# Altium project RFSOC_SAWG.PrjPCB (part 10 of 10)

## Sheet AWG_USB_Serial_Quad.SchDoc: RFSOC SAWG
size 420 x 297 mm; Author: Paweł Kulik; DrawnBy: G.Kasprowicz; Address1: Warsaw Univeristy of Technology; Address2: Nowowiejska 15/19; DocumentNumber: 9; Revision: 1; SheetNumber: 9; SheetTotal: 20; EDA_Number: ARTIQ; Projet: ARTIQ/SINARA; ModifiedBy: -; CheckedDate: -; Title2: USB Serial Quad; DivGrp: ISE; Designer: G.Kasprowicz; ProjectName: ARTIQ/SINARA
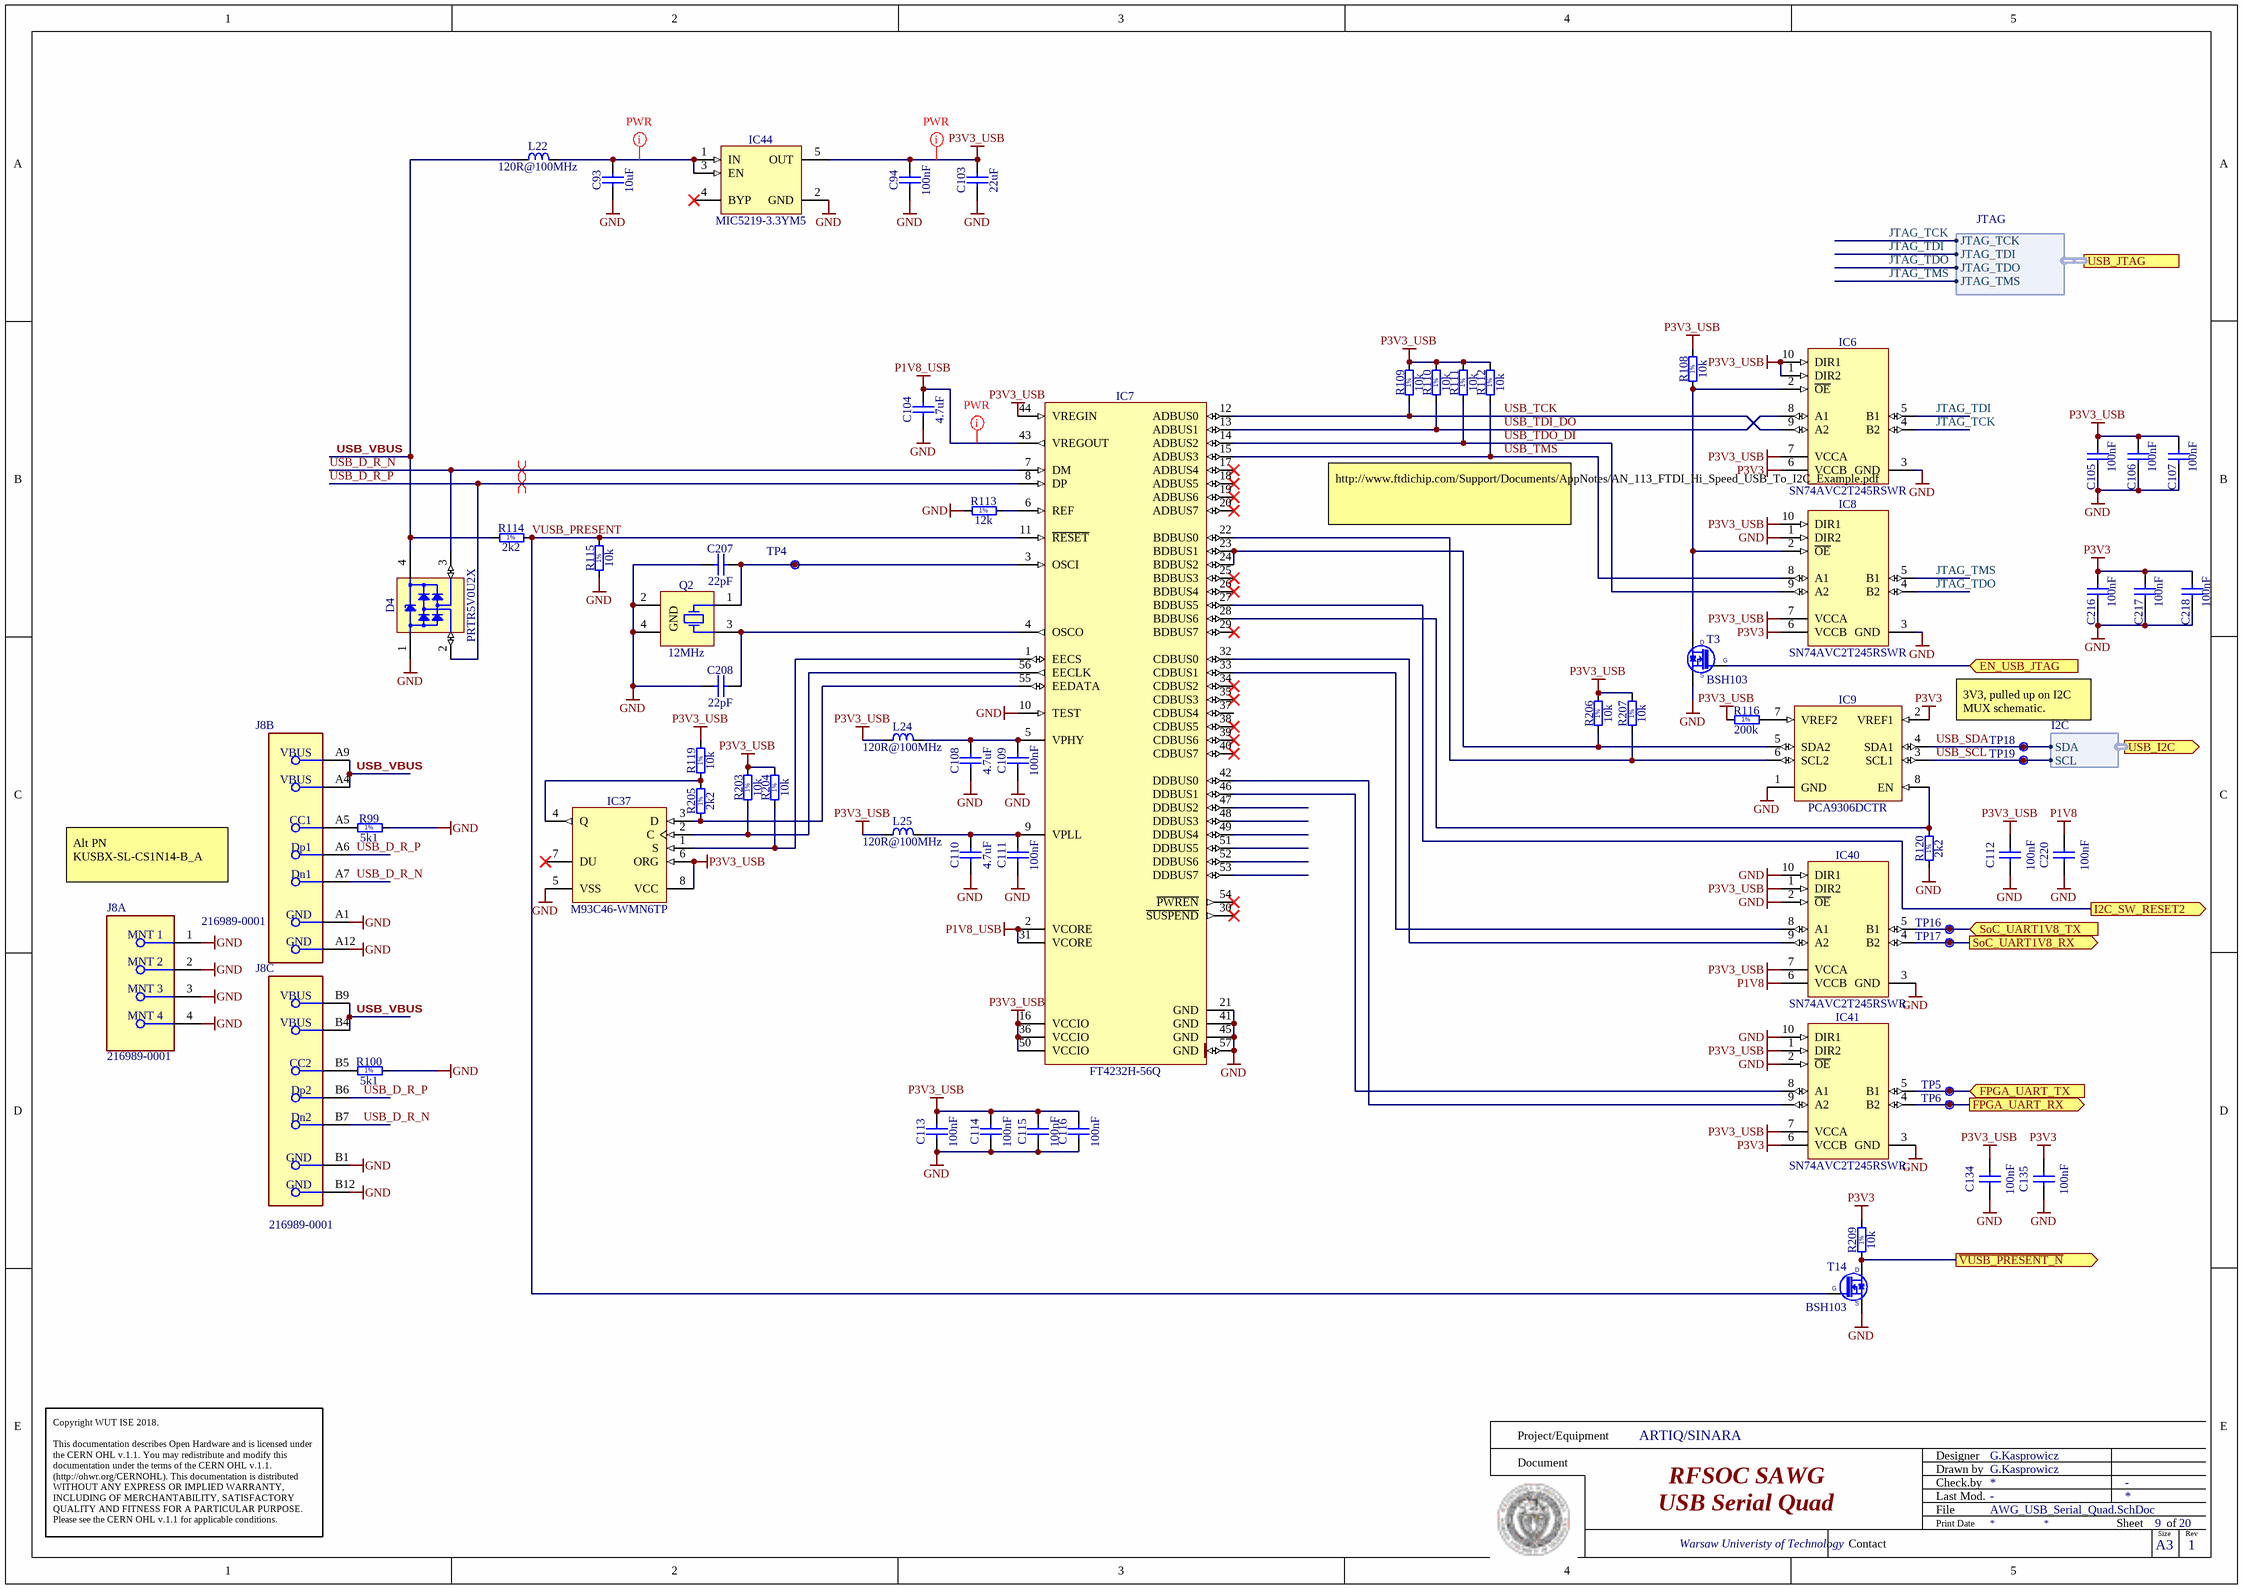
[diagram p19: AWG_USB_Serial_Quad.SchDoc]

### Parts
C93  10uF  [CAPC1608X87N]
C94  100nF  [CAPC1005X55N]
C103  22uF  [CAPC1608X90N]
C104  4.7uF  [CAPC2012X135N]
C105  100nF  [CAPC0603X33N]
C106  100nF  [CAPC0603X33N]
C107  100nF  [CAPC0603X33N]
C108  4.7uF  [CAPC2012X135N]
C109  100nF  [CAPC1005X55N]
C110  4.7uF  [CAPC2012X135N]
C111  100nF  [CAPC1005X55N]
C112  100nF  [CAPC0603X33N]
C113  100nF  [CAPC1005X55N]
C114  100nF  [CAPC1005X55N]
C115  100nF  [CAPC1005X55N]
C116  100nF  [CAPC1005X55N]
C134  100nF  [CAPC0603X33N]
C135  100nF  [CAPC0603X33N]
C207  22pF  [CAPC1005X55N]
C208  22pF  [CAPC1005X55N]
C216  100nF  [CAPC0603X33N]
C217  100nF  [CAPC0603X33N]
C218  100nF  [CAPC0603X33N]
C220  100nF  [CAPC0603X33N]
D4  PRTR5V0U2X  [SOT190P230X110-4N]
IC6  SN74AVC2T245RSWR  [QFN40P140X180X55-10N]
IC7  FT4232H-56Q  [QFN50P800X800X100-57N-S620]
IC8  SN74AVC2T245RSWR  [QFN40P140X180X55-10N]
IC9  PCA9306DCTR  [SOP65P400X130-8N]
IC37  M93C46-WMN6TP  [SOIC127P600X175-8N]
IC40  SN74AVC2T245RSWR  [QFN40P140X180X55-10N]
IC41  SN74AVC2T245RSWR  [QFN40P140X180X55-10N]
IC44  MIC5219-3.3YM5  [SOT95P280X145-5N]
J8  216989-0001  [FP-216989-0001-MFG]  (parts A,B,C of 3)
L22  120R@100MHz  [INDC1608X65N]
L24  120R@100MHz  [INDC1608X65N]
L25  120R@100MHz  [INDC1608X65N]
Q2  12MHz  [XTAL_TXC_7M]
R99  5k1  [RESC1005X40N]
R100  5k1  [RESC1005X40N]
R108  10k  [RESC1005X40N]
R109  10k  [RESC1005X40N]
R110  10k  [RESC1005X40N]
R111  10k  [RESC1005X40N]
R112  10k  [RESC1005X40N]
R113  12k  [RESC1005X40N]
R114  2k2  [RESC1005X40N]
R115  10k  [RESC1005X40N]
R116  200k  [RESC1005X40N]
R119  10k  [RESC1005X40N]
R120  2k2  [RESC1005X40N]
R203  10k  [RESC1005X40N]
R204  10k  [RESC1005X40N]
R205  2k2  [RESC1005X40N]
R206  10k  [RESC1005X40N]
R207  10k  [RESC1005X40N]
R209  10k  [RESC1005X40N]
T3  BSH103  [SOT95P230X110-3N]
T14  BSH103  [SOT95P230X110-3N]
TP4  Test Point  [TPS127]  (value not drawn)  (no BOM)
TP5  Test Point  [TPS127]  (value not drawn)  (no BOM)
TP6  Test Point  [TPS127]  (value not drawn)  (no BOM)
TP16  Test Point  [TPS127]  (value not drawn)  (no BOM)
TP17  Test Point  [TPS127]  (value not drawn)  (no BOM)
TP18  Test Point  [TPS127]  (value not drawn)  (no BOM)
TP19  Test Point  [TPS127]  (value not drawn)  (no BOM)

### Ports
EN_USB_JTAG (in), FPGA_UART_RX (out), FPGA_UART_TX (in), I2C_SW_RESET2 (out), SoC_UART1V8_RX (out), SoC_UART1V8_TX (in), USB_I2C (out, harness I2C), USB_JTAG (harness JTAG), ~{VUSB_PRESENT_N} (out)

### Harnesses
JTAG: JTAG_TCK, JTAG_TDI, JTAG_TDO, JTAG_TMS
I2C: SDA, SCL

### Nets
GND: C93.1 C94.1 C103.1 C104.1 C105.1 C106.1 C107.1 C108.1 C109.1 C110.1 C111.1 C112.1 C113.1 C114.1 C115.1 C116.1 C134.1 C135.1 C207.1 C208.1 C216.1 C217.1 C218.1 C220.1 D4.1(GND) IC6.3(GND) IC7.10(TEST) IC7.21(GND) IC7.41(GND) IC7.45(GND) IC7.57(GND) IC8.1(DIR2) IC8.3(GND) IC9.1(GND) IC37.5(VSS) IC40.2(~{OE}) IC40.3(GND) IC40.10(DIR1) IC41.2(~{OE}) IC41.3(GND) IC41.10(DIR1) IC44.2(GND) J8.1(MNT_1) J8.2(MNT_2) J8.3(MNT_3) J8.4(MNT_4) J8.A1(GND) J8.A12(GND) J8.B1(GND) J8.B12(GND) Q2.2(GND) Q2.4(GND) R99.2 R100.2 R113.1 R115.1 R120.1 T3.2(S) T14.2(S)
P1V8: C220.2 IC40.6(VCCB)
P1V8_USB: C104.2 IC7.2(VCORE) IC7.31(VCORE) IC7.43(VREGOUT)
P3V3: C135.2 C216.2 C217.2 C218.2 IC6.6(VCCB) IC8.6(VCCB) IC9.2(VREF1) IC41.6(VCCB) R209.2
P3V3_USB: C94.2 C103.2 C105.2 C106.2 C107.2 C112.2 C113.2 C114.2 C115.2 C116.2 C134.2 IC6.1(DIR2) IC6.7(VCCA) IC6.10(DIR1) IC7.16(VCCIO) IC7.36(VCCIO) IC7.44(VREGIN) IC7.50(VCCIO) IC8.7(VCCA) IC8.10(DIR1) IC37.6(ORG) IC37.8(VCC) IC40.1(DIR2) IC40.7(VCCA) IC41.1(DIR2) IC41.7(VCCA) IC44.5(OUT) L24.1 L25.1 R108.2 R109.2 R110.2 R111.2 R112.2 R116.1 R119.2 R203.2 R204.2 R206.2 R207.2
~{VUSB_PRESENT_N}: R209.1 T14.3(D) ; port ~{VUSB_PRESENT_N}
CPLD_IO2: IC41.5(B1) TP5.1 ; port FPGA_UART_TX
EN_USB_JTAG: T3.1(G) ; port EN_USB_JTAG
FPGA_UART_RX: IC41.4(B2) TP6.1 ; port FPGA_UART_RX
I2C_SW_RESET2: IC7.27(BDBUS5) ; port I2C_SW_RESET2
JTAG_TCK: IC6.4(B2) ; port USB_JTAG.JTAG_TCK
JTAG_TDI: IC6.5(B1) ; port USB_JTAG.JTAG_TDI
JTAG_TDO: IC8.4(B2) ; port USB_JTAG.JTAG_TDO
JTAG_TMS: IC8.5(B1) ; port USB_JTAG.JTAG_TMS
UART0_RX: IC40.4(B2) TP17.1 ; port SoC_UART1V8_RX
UART0_TX: IC40.5(B1) TP16.1 ; port SoC_UART1V8_TX
USB_D_R_N: D4.3(I/O2) IC7.7(DM) J8.A7(Dn1) J8.B7(Dn2)
USB_D_R_P: D4.2(I/O1) IC7.8(DP) J8.A6(Dp1) J8.B6(Dp2)
USB_SCL: IC9.3(SCL1) TP19.1 ; port USB_I2C.SCL
USB_SDA: IC9.4(SDA1) TP18.1 ; port USB_I2C.SDA
USB_TCK: IC6.9(A2) IC7.12(ADBUS0) R109.1
USB_TDI_DO: IC6.8(A1) IC7.13(ADBUS1) R110.1
USB_TDO_DI: IC7.14(ADBUS2) IC8.9(A2) R111.1
USB_TMS: IC7.15(ADBUS3) IC8.8(A1) R112.1
USB_VBUS: D4.4(VCC) J8.A4(VBUS) J8.A9(VBUS) J8.B4(VBUS) J8.B9(VBUS) L22.1 R114.1
VUSB_PRESENT: IC7.11(~{RESET}) R114.2 R115.2 T14.1(G)
NetC93_2: C93.2 IC44.1(IN) IC44.3(EN) L22.2
NetC108_2: C108.2 C109.2 IC7.5(VPHY) L24.2
NetC110_2: C110.2 C111.2 IC7.9(VPLL) L25.2
NetC207_2: C207.2 IC7.3(OSCI) Q2.1(X) TP4.1
NetC208_2: C208.2 IC7.4(OSCO) Q2.3(X)
NetIC6_2: IC6.2(~{OE}) IC8.2(~{OE}) R108.1 T3.3(D)
NetIC7_1: IC7.1(EECS) IC37.1(S) R204.1
NetIC7_6: IC7.6(REF) R113.2
NetIC7_22: IC7.22(BDBUS0) IC9.6(SCL2) R207.1
NetIC7_23: IC7.23(BDBUS1) IC7.24(BDBUS2) IC9.5(SDA2) R206.1
NetIC7_28: IC7.28(BDBUS6) IC9.8(EN) R120.2
NetIC7_32: IC7.32(CDBUS0) IC40.9(A2)
NetIC7_33: IC7.33(CDBUS1) IC40.8(A1)
NetIC7_42: IC7.42(DDBUS0) IC41.9(A2)
NetIC7_46: IC7.46(DDBUS1) IC41.8(A1)
NetIC7_55: IC7.55(EEDATA) IC37.3(D) R205.2
NetIC7_56: IC7.56(EECLK) IC37.2(C) R203.1
NetIC9_7: IC9.7(VREF2) R116.2
NetIC37_4: IC37.4(Q) R119.1 R205.1
NetJ8_A5: J8.A5(CC1) R99.1
NetJ8_B5: J8.B5(CC2) R100.1

Not connected (* = marked no-connect by the designer): IC7 17(ADBUS4)* 18(ADBUS5)* 19(ADBUS6)* 20(ADBUS7)* 25(BDBUS3)* 26(BDBUS4)* 29(BDBUS7)* 30(~{SUSPEND})* 34(CDBUS2)* 35(CDBUS3)* 37(CDBUS4) 38(CDBUS5)* 39(CDBUS6)* 40(CDBUS7)* 47(DDBUS2) 48(DDBUS3) 49(DDBUS4) 51(DDBUS5) 52(DDBUS6) 53(DDBUS7) 54(~{PWREN})*; IC37 7(DU)*; IC44 4(BYP)*

### Layout directives
differential pair; differential pair class Diff_90Ohm: USB_D_R_N, USB_D_R_P
net class PWR: NetC93_2, P1V8_USB, P3V3_USB

### Notes on the sheet
- http://www.ftdichip.com/Support/Documents/AppNotes/AN_113_FTDI_Hi_Speed_USB_To_I2C_Example.pdf
- 3V3, pulled up on I2C MUX schematic.
- Alt PN KUSBX-SL-CS1N14-B_A
- Project/Equipment
- Document
- Designer
- Drawn by
- Check.by
- Copyright WUT ISE 2018.
  This documentation describes Open Hardware and is licensed under the CERN OHL v.1.1. You may redistribute and modify this documentation under the terms of the CERN OHL v.1.1. (http://ohwr.org/CERNOHL). This documentation is distributed WITHOUT ANY EXPRESS OR IMPLIED WARRANTY, INCLUDING OF MERCHANTABILITY, SATISFACTORY QUALITY AND FITNESS FOR A PARTICULAR PURPOSE. Please see the CERN OHL v.1.1 for applicable conditions.
- Contact
- File
- Last Mod.
- Print Date
- Sheet
- Size
- A3
- of
- Rev
- (in symbol R0402_2K2_1%_0.0625W_100PPM) 1%
- (in symbol R0402_5K1_1%_0.0625W_100PPM) 1%
- (in symbol R0402_10K_1%_0.0625W_100PPM) 1%
- (in symbol R0402_12K_1%_0.0625W_100PPM) 1%
- (in symbol R0402_200K_1%_0.0625W_100PPM) 1%

### Library data of the parts
C93 = CC0603_10UF_6.3V_20%_X5R: Non-polarised capacitor; Part Description: SMD Multilayer Chip Ceramic Capacitor; Manufacturer: GENERIC; Manufacturer1 Part Number: C0603C106M9PAC; Voltage: 6.3V; TC: X5R; Tolerance: ±20%; Part Number: CC0603_10UF_6.3V_20%_X5R; Component Kind: Standard; Component Type: Standard; Pin Count: 2; Value: 10uF; Status: Preferred; Manufacturer Part Number: CC0603_10uF_6.3V_20%_X5R; Case: 0603; Mounted: Yes; Socket: No; SMD: Yes; Sense: No; Manufacturer1 Example: KEMET; Manufacturer1 ComponentHeight: 0.95mm; HelpURL: \\cern.ch\dfs\Applications\Altium\Datasheets\CC0603_X5R_KEMET.pdf; Author: CERN DEM JLC; CreateDate: 2007-12-03; LatestRevisionDate: 2007-12-03
C94 C109 C111 C113-C116 = CC0402_100NF_16V_10%_X5R: Non-polarised capacitor; Part Description: SMD Multilayer Chip Ceramic Capacitor; Manufacturer: GENERIC; Manufacturer1 Part Number: GRM155R61C104KA88D; Voltage: 16V; TC: X5R; Tolerance: ±10%; Part Number: CC0402_100NF_16V_10%_X5R; Component Kind: Standard; Component Type: Standard; Pin Count: 2; Value: 100nF; Status: None; Manufacturer Part Number: CC0402_100NF_16V_10%_X5R; Case: 0402; Mounted: Yes; Socket: No; SMD: Yes; Sense: No; Manufacturer1 Example: MURATA; Manufacturer1 ComponentHeight: 0.55mm; HelpURL: \\cern.ch\dfs\Applications\Altium\Datasheets\CC0402_X5R_MURATA_GRM.pdf; Author: CERN DEM JLC; CreateDate: 10.12.2013; LatestRevisionDate: 10.12.2013
C103 = CC0603_22UF_6.3V_20%_X5R: Non-polarised capacitor; Part Description: SMD Multilayer Chip Ceramic Capacitor; Manufacturer: GENERIC; Manufacturer1 Part Number: C1608X5R0J226M080; Voltage: 6.3V; TC: X5R; Tolerance: ±20%; Part Number: CC0603_22UF_6.3V_20%_X5R; Component Kind: Standard; Component Type: Standard; Pin Count: 2; Value: 22uF; Status: None; Manufacturer Part Number: CC0603_22UF_6.3V_20%_X5R; Case: 0603; Mounted: Yes; Socket: No; SMD: Yes; Sense: No; Manufacturer1 Example: TDK; Manufacturer1 ComponentHeight: 0.9mm; HelpURL: \\cern.ch\dfs\Applications\Altium\Datasheets\CC0603_X5R_TDK_C.pdf; Author: CERN DEM JLC; CreateDate: 16.12.2013; LatestRevisionDate: 03.12.2020
C104 C108 C110 = CC0805_4.7UF_10V_10%_X5R: Non-polarised capacitor; Part Description: SMD Multilayer Chip Ceramic Capacitor; Manufacturer: GENERIC; Manufacturer1 Part Number: 222224013672; Voltage: 10V; TC: X5R; Tolerance: ±10%; Part Number: CC0805_4.7UF_10V_10%_X5R; Component Kind: Standard; Component Type: Standard; Pin Count: 2; Value: 4.7uF; Status: Preferred; Manufacturer Part Number: CC0805_4.7UF_10V_10%_X5R; Case: 0805; Mounted: Yes; Socket: No; SMD: Yes; Sense: No; Manufacturer1 Example: PHYCOMP; Manufacturer1 ComponentHeight: 1.45mm; HelpURL: \\cern.ch\dfs\Applications\Altium\Datasheets\CC0805_X5R_PHYCOMP_HC.pdf; Author: CERN DEM JLC; CreateDate: 03.12.2007; LatestRevisionDate: 03.12.2007
C105-C107 C112 C134 C135 C216-C218 C220 = CC0201_100NF_6.3V_10%_X5R: Non-polarised capacitor; Part Description: SMD Multilayer Chip Ceramic Capacitor; Manufacturer: GENERIC; Manufacturer1 Part Number: 02016D104KAT2A; Voltage: 6.3V; TC: X5R; Tolerance: ±10%; Part Number: CC0201_100NF_6.3V_10%_X5R; Component Kind: Standard; Component Type: Standard; Pin Count: 2; Value: 100nF; Status: Not Recommended; Manufacturer Part Number: CC0201_100NF_6.3V_10%_X5R; Case: 0201; Mounted: Yes; Socket: No; SMD: Yes; Sense: No; Manufacturer1 Example: AVX; Manufacturer1 ComponentHeight: 0.33mm; HelpURL: \\cern.ch\dfs\Applications\Altium\Datasheets\CC0201_X5R_AVX.pdf; Author: CERN DEM JLC; CreateDate: 2007-12-03; LatestRevisionDate: 2007-12-03
C207 C208 = CC0402_22PF_50V_5%_C0G: Non-polarised capacitor; Part Description: SMD Multilayer Chip Ceramic Capacitor; Manufacturer: GENERIC; Manufacturer1 Part Number: C0402C220J5GACTU; Voltage: 50V; TC: C0G/NP0; Tolerance: ±5%; Part Number: CC0402_22PF_50V_5%_C0G; Component Kind: Standard; Component Type: Standard; Pin Count: 2; Value: 22pF; Status: Preferred; Manufacturer Part Number: CC0402_22PF_50V_5%_C0G; Case: 0402; Mounted: Yes; Socket: No; SMD: Yes; Sense: No; Manufacturer1 Example: KEMET; Manufacturer1 ComponentHeight: 0.55mm; HelpURL: \\cern.ch\dfs\Applications\Altium\Datasheets\CC0805_C0G_KEMET_(Commercial Grade).pdf; Author: CERN DEM JLC; CreateDate: 03.12.2007; LatestRevisionDate: 03.12.2007
D4 = PRTR5V0U2X: Ultra Low Capacitance Double Rail-to-Rail ESD Protection Diode; Part Description: Ultra Low Capacitance (1pF) Double Rail-to-Rail ESD Protection Diode (8kV); Manufacturer: NXP SEMICONDUCTORS; Voltage: 5.5V; PressFit: No; Bonding: No; Part Number: PRTR5V0U2X; Component Kind: Standard; Component Type: Standard; Device: PRTR5V0U2X; PackageDescription: SOT143B, SOT, 1.90mm Pitch; 4 Pin, 1.30mm W X 2.90mm L X 1.10mm H body, IPC Medium Density; Manufacturer Part Number: PRTR5V0U2X; Pin Count: 4; Case: SOT143B; Mounted: Yes; Socket: No; SMD: Yes; Sense: No; ComponentHeight: 1.1mm; HelpURL: \\cern.ch\dfs\Applications\Altium\Datasheets\PRTR5V0U2X.pdf; Author: CERN DEM JLC; CreateDate: 22.03.2011; LatestRevisionDate: 22.03.2011
IC6 IC8 IC40 IC41 = SN74AVC2T245RSWR: Dual-Bit Dual-Supply Bus Transceiver With Configurable Voltage Translation and 3-State Outputs; Manufacturer: TEXAS INSTRUMENTS; PressFit: No; Bonding: No; Part Number: SN74AVC2T245RSWR; Component Kind: Standard; Component Type: Standard; Device: SN74AVC2T245RSWR; PackageDescription: QFN, 0.40mm Pitch, Rect.;10 Pin, 1.80mm L X 1.40mm W X 0.55mm H Body, IPC Medium Density; Status: Not Recommended; Part Description: Dual-Bit Dual-Supply Bus Transceiver With Configurable Voltage Translation and 3-State Outputs; Manufacturer Part Number: SN74AVC2T245RSWR; Pin Count: 10; Case: QFN10; Mounted: Yes; Socket: No; SMD: Yes; Sense: No; ComponentHeight: 0.55mm; Author: CERN DEM JLC; HelpURL: \\cern.ch\dfs\Applications\Altium\Datasheets\SN74AVC2T245RSWR.pdf; CreateDate: 07.07.2014; LatestRevisionDate: 30.03.2017
IC7 = FT4232H-56Q: Quad High Speed USB to Multipurpose UART/MPSSE IC; Manufacturer: FUTURE TECHNOLOGY DEVICES INTERNATIONAL (FTDI); PressFit: No; Bonding: No; Part Number: FT4232H-56Q; Component Kind: Standard; Component Type: Standard; Device: FT4232H-56Q; PackageDescription: QFN, 0.50mm Pitch, Square; 56 Pin, 8.00mm L X 8.00mm W X 1.00mm H body (6.1mm X 6.1mm Thermal tab), IPC Medium Density; Part Description: Quad High Speed USB to Multipurpose UART/MPSSE IC; Manufacturer Part Number: FT4232H-56Q; Pin Count: 57; Case: QFN56; Mounted: Yes; Socket: No; SMD: Yes; Sense: No; ComponentHeight: 1mm; Author: CERN DEM JLC; HelpURL: \\cern.ch\dfs\Applications\Altium\Datasheets\FT4232H-56Q.pdf; CreateDate: 11.10.2016; LatestRevisionDate: 11.10.2016
IC9 = PCA9306DCTR: Dual Bidirectional I2C Bus And SMBus Voltage-Level Translator; Manufacturer: TEXAS INSTRUMENTS; PressFit: No; Bonding: No; Part Number: PCA9306DCTR; Component Kind: Standard; Component Type: Standard; Device: PCA9306DCTR; PackageDescription: SOP, 0.65mm, Pitch; 8 Pin, 2.80mm W X 2.95mm L X 1.30mm H Body, PC Medium Density; Part Description: Dual Bidirectional I2C Bus And SMBus Voltage-Level Translator; Manufacturer Part Number: PCA9306DCTR; Pin Count: 8; Case: SSOP8; Mounted: Yes; Socket: No; SMD: Yes; Sense: No; ComponentHeight: 1.3mm; Author: CERN DEM JLC; HelpURL: \\cern.ch\dfs\Applications\Altium\Datasheets\PCA9306DCTR.pdf; CreateDate: 25.02.2013; LatestRevisionDate: 11.02.2016
IC37 = M93C46-WMN6TP: 2.5 to 5.5 V, 1Kb (128x8) Serial Microwire Bus EEPROM; Part Description: 1Kbit (128 x 8 bit or 64 x 16 bit) MICROWIRE® Serial Access EEPROM; Manufacturer: ST MICROELECTRONICS; PressFit: No; Bonding: No; Part Number: M93C46-WMN6TP; Component Kind: Standard; Component Type: Standard; Device: M93C46-WMN6TP; PackageDescription: SOIC 8, Pitch 1.27mm - Body 4x5mm, IPC Medium Density; Manufacturer Part Number: M93C46-WMN6TP; Pin Count: 8; Case: SOIC8; Mounted: Yes; Socket: No; SMD: Yes; Sense: No; ComponentHeight: 1.75mm; HelpURL: \\cern.ch\dfs\Applications\Altium\Datasheets\M93C46-WMN6TP.pdf; Author: CERN DEM JLC; CreateDate: 15.11.2012; LatestRevisionDate: 15.11.2012
IC44 = MIC5219-3.3YM5: 500mA Peak Output LDO Regulator; Part Description: 3.3V 500mA Peak Output Low Drop-Out  (LDO) Regulator; Manufacturer: MICROCHIP TECHNOLOGY; PressFit: No; Bonding: No; Part Number: MIC5219-3.3YM5; Component Kind: Standard; Component Type: Standard; Device: MIC5219-3.3YM5; PackageDescription: SOT, 0.95mm pitch; 5 pin, 1.60mm W X 2.90mm L X 1.45mm H body, IPC Medium Density; Manufacturer Part Number: MIC5219-3.3YM5; Pin Count: 5; Case: SOT23-5; Mounted: Yes; Socket: No; SMD: Yes; Sense: No; ComponentHeight: 1.45mm; HelpURL: \\cern.ch\dfs\Applications\Altium\Datasheets\MIC5219-3.3YM5.pdf; Author: CERN DEM WB; CreateDate: 2019-04-16; LatestRevisionDate: 2019-04-16
J8 = CMP-04767-000020-1: CONN RCPT USB2.0 TYPE C 24POS RA; Manufacturer Part Number: 216989-0001
L22 L24 L25 = IND0603_MURATA_BLM18SG121TN1D: Inductor; Part Description: SMD EMIFIL Suppression Chip Ferrite Bead; Manufacturer: MURATA; Power: 3A; Resistance: 0.025R; Tolerance: ±25%; Part Number: IND0603_MURATA_BLM18SG121TN1D; Component Kind: Standard; Component Type: Standard; Pin Count: 2; Value: 120R@100MHz; Status: None; Manufacturer Part Number: BLM18SG121TN1D; Case: 0603; Mounted: Yes; Socket: No; SMD: Yes; Sense: No; ComponentHeight: 0.65mm; HelpURL: \\cern.ch\dfs\Applications\Altium\Datasheets\IND0603_MURATA_BLM18S.pdf; Author: CERN DEM JLC; CreateDate: 23.07.2014; LatestRevisionDate: 23.07.2014
Q2 = XTAL_12MHZ_TXC_7M-12.000MAAJ-T: Crystal 4 pins 1=XTAL Control 2=GND3=XTAL 4=GND; Part Description: ±30ppm 18pF -20°C to +70°C  4 Pins, 3.2x2.5X0.8mm, SMD Sealing Crystal, 7M Series; Manufacturer: TXC CORPORATION; PressFit: No; Bonding: No; Part Number: XTAL_12MHZ_TXC_7M-12.000MAAJ-T; Component Kind: Standard; Component Type: Standard; PackageDescription: 4 Pins, 2.5x3.2mm, SMD Sealing Crystal, 7M Serie; Value: 12MHz; Manufacturer Part Number: 7M-12.000MAAJ-T; Pin Count: 4; Mounted: Yes; Socket: No; SMD: Yes; Sense: No; ComponentHeight: 0.8mm; HelpURL: \\cern.ch\dfs\Applications\Altium\Datasheets\XTAL_TXC_7M.pdf; Author: CERN DEM JLC; CreateDate: 19.06.2012; LatestRevisionDate: 19.06.2012
R99 R100 = R0402_5K1_1%_0.0625W_100PPM: Resistor - 1%; Part Description: General Purpose Thick Film Chip Resistor; Manufacturer: GENERIC; Manufacturer1 Part Number: 232270675102L; TC: ±100ppm/°C; PressFit: No; Part Number: R0402_5K1_1%_0.0625W_100PPM; Component Kind: Standard; Component Type: Standard; Pin Count: 2; Value: 5k1; Status: Not Recommended; Power: 0.0625W; Tolerance: ±1%; Manufacturer Part Number: R0402_5K1_1%_0.0625W_100PPM; Case: 0402; Mounted: Yes; Sense: No; Socket: No; SMD: Yes; Manufacturer1 Example: YAGEO PHYCOMP; Manufacturer1 ComponentHeight: 0.4mm; HelpURL: \\cern.ch\dfs\Applications\Altium\Datasheets\R0402_Phycomp_RC0402.pdf; Author: CERN DEM JLC; CreateDate: 03.12.2007; LatestRevisionDate: 17.10.2012
R108-R112 R115 R119 R203 R204 R206 R207 R209 = R0402_10K_1%_0.0625W_100PPM: Resistor - 1%; Part Description: General Purpose Thick Film Chip Resistor; Manufacturer: GENERIC; Manufacturer1 Part Number: 232270671003L; TC: ±100ppm/°C; PressFit: No; Part Number: R0402_10K_1%_0.0625W_100PPM; Component Kind: Standard; Component Type: Standard; Pin Count: 2; Value: 10k; Status: Not Recommended; Power: 0.0625W; Tolerance: ±1%; Manufacturer Part Number: R0402_10K_1%_0.0625W_100PPM; Case: 0402; Mounted: Yes; Socket: No; SMD: Yes; Manufacturer1 Example: YAGEO PHYCOMP; Manufacturer1 ComponentHeight: 0.4mm; HelpURL: \\cern.ch\dfs\Applications\Altium\Datasheets\R0402_Phycomp_RC0402.pdf; Author: CERN DEM JLC; CreateDate: 03.12.2007; LatestRevisionDate: 17.10.2012; Sense: No
R113 = R0402_12K_1%_0.0625W_100PPM: Resistor - 1%; Part Description: General Purpose Thick Film Chip Resistor; Manufacturer: GENERIC; Manufacturer1 Part Number: 232270671203L; TC: ±100ppm/°C; PressFit: No; Part Number: R0402_12K_1%_0.0625W_100PPM; Component Kind: Standard; Component Type: Standard; Pin Count: 2; Value: 12k; Status: Not Recommended; Power: 0.0625W; Tolerance: ±1%; Manufacturer Part Number: R0402_12K_1%_0.0625W_100PPM; Case: 0402; Mounted: Yes; Sense: No; Socket: No; SMD: Yes; Manufacturer1 Example: YAGEO PHYCOMP; Manufacturer1 ComponentHeight: 0.4mm; HelpURL: \\cern.ch\dfs\Applications\Altium\Datasheets\R0402_Phycomp_RC0402.pdf; Author: CERN DEM JLC; CreateDate: 03.12.2007; LatestRevisionDate: 17.10.2012
R114 R120 R205 = R0402_2K2_1%_0.0625W_100PPM: Resistor - 1%; Part Description: General Purpose Thick Film Chip Resistor; Manufacturer: GENERIC; Manufacturer1 Part Number: 232270672202L; TC: ±100ppm/°C; PressFit: No; Part Number: R0402_2K2_1%_0.0625W_100PPM; Component Kind: Standard; Component Type: Standard; Pin Count: 2; Value: 2k2; Status: Not Recommended; Power: 0.0625W; Tolerance: ±1%; Manufacturer Part Number: R0402_2K2_1%_0.0625W_100PPM; Case: 0402; Mounted: Yes; Sense: No; Socket: No; SMD: Yes; Manufacturer1 Example: YAGEO PHYCOMP; Manufacturer1 ComponentHeight: 0.4mm; HelpURL: \\cern.ch\dfs\Applications\Altium\Datasheets\R0402_Phycomp_RC0402.pdf; Author: CERN DEM JLC; CreateDate: 03.12.2007; LatestRevisionDate: 17.10.2012
R116 = R0402_200K_1%_0.0625W_100PPM: Resistor - 1%; Part Description: General Purpose Thick Film Chip Resistor; Manufacturer: GENERIC; Manufacturer1 Part Number: 232270672004L; TC: ±100ppm/°C; PressFit: No; Part Number: R0402_200K_1%_0.0625W_100PPM; Component Kind: Standard; Component Type: Standard; Pin Count: 2; Value: 200k; Status: Not Recommended; Power: 0.0625W; Tolerance: ±1%; Manufacturer Part Number: R0402_200K_1%_0.0625W_100PPM; Case: 0402; Mounted: Yes; Sense: No; Socket: No; SMD: Yes; Manufacturer1 Example: YAGEO PHYCOMP; Manufacturer1 ComponentHeight: 0.4mm; HelpURL: \\cern.ch\dfs\Applications\Altium\Datasheets\R0402_Phycomp_RC0402.pdf; Author: CERN DEM JLC; CreateDate: 03.12.2007; LatestRevisionDate: 17.10.2012
T3 T14 = BSH103: N-CHANNEL MOSFET WITH DIODE; Part Description: 30V 850mA N-Channel Enhancement Mode Field-Effect Transistor; Manufacturer: NEXPERIA; PressFit: No; Bonding: No; Part Number: BSH103; Component Kind: Standard; Component Type: Standard; Device: BSH103; PackageDescription: SOT23, 3 pin, Pitch 0.95mm - 1.3mm W X 2.9mm L X 1.1mm H, IPC Medium Density; Manufacturer Part Number: BSH103; Pin Count: 3; Case: SOT23-3; Mounted: Yes; Socket: No; SMD: Yes; Sense: No; ComponentHeight: 1.1mm; HelpURL: \\cern.ch\dfs\Applications\Altium\Datasheets\BSH103.pdf; Author: CERN DEM JLC; CreateDate: 16.03.2010; LatestRevisionDate: 20.06.2017
TP4-TP6 TP16-TP19 = SMD_PAD_1.27X1.27MM: Part Description: 1.27mm x 1.27mm PCB Copper Area (SMD Test Point); Mounted: No; Part Number: SMD_PAD_1.27X1.27MM; Component Type: Standard (No BOM); Pin Count: 1; Family: Test Point; Socket: No; SMD: Yes; Sense: No; Status: None; ComponentHeight: 0mm; HelpURL: Undefined; Author: CERN DEM JLC; CreateDate: 12.01.2008; LatestRevisionDate: 12.01.2008; PackageDescription: 1.27mm x 1.27mm PCB Copper Area (SMD Test Point)

## Nets that join several sheets
GND: RFSOC_SAWG (33 pins), AWG_CLK_Connectors (10 pins), FireFly_AB (50 pins), I2C_MUX (23 pins), SD (17 pins), B2B_1 (47 pins), B2B_2 (48 pins), PWR_3V3 (28 pins), PWR_1V8 (10 pins), PWR_5V (62 pins), AWG_CPCIS_Connectors_P1_P6 (32 pins), AWG_EEM_Connectors_JTAG (56 pins), U_DAC_Output_CH0 (17 pins), U_DAC_Output_CH1 (17 pins), U_DAC_Output_CH2 (17 pins), U_DAC_Output_CH3 (17 pins), U_DAC_Output_CH4 (17 pins), U_DAC_Output_CH5 (17 pins), U_DAC_Output_CH6 (17 pins), U_DAC_Output_CH7 (17 pins), U_ADC_Input_CH0 (7 pins), U_ADC_Input_CH1 (7 pins), U_ADC_Input_CH2 (7 pins), U_ADC_Input_CH3 (7 pins), U_ADC_Input_CH4 (7 pins), U_ADC_Input_CH5 (7 pins), U_ADC_Input_CH6 (7 pins), U_ADC_Input_CH7 (7 pins), AWG_SFPs (49 pins), AWG_ClockRecovery (92 pins), U_RF_PLL_channel2 (42 pins), U_RF_PLL_channel0 (42 pins), U_RF_PLL_channel1 (42 pins), SPI_Extender (25 pins), AWG_mechanics (5 pins), AWG_USB_Serial_Quad (59 pins)
P1V8: I2C_MUX (C193.2 IC13.2 R165.2 R166.2), SD (5 pins), B2B_1 (D13.2 R208.1), PWR_1V8 (6 pins), PWR_5V (B22.1 R20.1), AWG_ClockRecovery (R73.1 R75.1), AWG_USB_Serial_Quad (C220.2 IC40.6)
P3V3: RFSOC_SAWG (9 pins), FireFly_AB (10 pins), I2C_MUX (32 pins), SD (C99.1 Q1.4 R199.1 R200.2), B2B_2 (C159.2 IC21.16), PWR_3V3 (9 pins), PWR_1V8 (C55.1 IC1.1 IC1.2 IC1.3), PWR_5V (6 pins), AWG_EEM_Connectors_JTAG (27 pins), AWG_SFPs (16 pins), AWG_ClockRecovery (8 pins), SPI_Extender (16 pins), AWG_USB_Serial_Quad (9 pins)
P3V3_LDO2: AWG_CLK_Connectors (C225.2 IC29.1 IC29.6 IC29.10), AWG_ClockRecovery (8 pins)
P3V3_MP: PWR_3V3 (R278.2), PWR_5V (C245.2 IC33.8 R186.2 R187.2), AWG_EEM_Connectors_JTAG (C219.2 IC3.6 IC25.8 J32.30)
P3V3_MP_B: PWR_3V3 (C36.2 C37.2 IC14.5 R278.1), AWG_CPCIS_Connectors_P1_P6 (8 pins)
P3V3A: PWR_3V3 (6 pins), U_RF_PLL_channel2 (L26A.1 L27A.2 L28A.2), U_RF_PLL_channel0 (L26B.1 L27B.2 L28B.2), U_RF_PLL_channel1 (L26C.1 L27C.2 L28C.2)
P3V6_CLK: PWR_5V (B20.1), AWG_ClockRecovery (8 pins)
P5V0: RFSOC_SAWG (P1.32 P1.34), B2B_1 (8 pins), PWR_3V3 (8 pins), PWR_5V (17 pins)
P5V0A: PWR_5V (8 pins), U_DAC_Output_CH0 (L54A.2), U_DAC_Output_CH1 (L54B.2), U_DAC_Output_CH2 (L54C.2), U_DAC_Output_CH3 (L54D.2), U_DAC_Output_CH4 (L54E.2), U_DAC_Output_CH5 (L54F.2), U_DAC_Output_CH6 (L54G.2), U_DAC_Output_CH7 (L54H.2), U_RF_PLL_channel2 (L20A.2), U_RF_PLL_channel0 (L20B.2), U_RF_PLL_channel1 (L20C.2)
P12V0: PWR_3V3 (R123.1), PWR_5V (15 pins), AWG_CPCIS_Connectors_P1_P6 (7 pins), AWG_EEM_Connectors_JTAG (J32.28 J32.29), AWG_ClockRecovery (C137.2 C201.2 IC19.3)
~{VUSB_PRESENT_N}: SPI_Extender (IC49.3), AWG_USB_Serial_Quad (R209.1 T14.3)
ADC0_IN: RFSOC_SAWG (J9.1), U_ADC_Input_CH0 (FL2A.1)
ADC0_IN: RFSOC_SAWG (J11.1), U_ADC_Input_CH1 (FL2B.1)
ADC0_IN: RFSOC_SAWG (J13.1), U_ADC_Input_CH2 (FL2C.1)
ADC0_IN: RFSOC_SAWG (J15.1), U_ADC_Input_CH3 (FL2D.1)
ADC0_IN: RFSOC_SAWG (J40.1), U_ADC_Input_CH4 (FL2E.1)
ADC0_IN: RFSOC_SAWG (J43.1), U_ADC_Input_CH5 (FL2F.1)
ADC0_IN: RFSOC_SAWG (J45.1), U_ADC_Input_CH6 (FL2G.1)
ADC0_IN: RFSOC_SAWG (J47.1), U_ADC_Input_CH7 (FL2H.1)
ADC0_N: B2B_2 (J25.29), U_ADC_Input_CH0 (R93A.2 R95A.1)
ADC0_N: B2B_2 (J25.41), U_ADC_Input_CH4 (R93E.2 R95E.1)
ADC0_N: B2B_2 (J25.47), U_ADC_Input_CH1 (R93B.2 R95B.1)
ADC0_N: B2B_2 (J25.59), U_ADC_Input_CH5 (R93F.2 R95F.1)
ADC0_N: B2B_2 (J25.65), U_ADC_Input_CH2 (R93C.2 R95C.1)
ADC0_N: B2B_2 (J25.77), U_ADC_Input_CH6 (R93G.2 R95G.1)
ADC0_N: B2B_2 (J25.83), U_ADC_Input_CH3 (R93D.2 R95D.1)
ADC0_N: B2B_2 (J25.95), U_ADC_Input_CH7 (R93H.2 R95H.1)
ADC0_P: B2B_2 (J25.31), U_ADC_Input_CH0 (R9A.2 R95A.2)
ADC0_P: B2B_2 (J25.43), U_ADC_Input_CH4 (R9E.2 R95E.2)
ADC0_P: B2B_2 (J25.49), U_ADC_Input_CH1 (R9B.2 R95B.2)
ADC0_P: B2B_2 (J25.61), U_ADC_Input_CH5 (R9F.2 R95F.2)
ADC0_P: B2B_2 (J25.67), U_ADC_Input_CH2 (R9C.2 R95C.2)
ADC0_P: B2B_2 (J25.79), U_ADC_Input_CH6 (R9G.2 R95G.2)
ADC0_P: B2B_2 (J25.85), U_ADC_Input_CH3 (R9D.2 R95D.2)
ADC0_P: B2B_2 (J25.97), U_ADC_Input_CH7 (R9H.2 R95H.2)
ADC_CLK_224_N: B2B_2 (J25.35), U_RF_PLL_channel0 (C15B.2 C124B.1)
ADC_CLK_224_P: B2B_2 (J25.37), U_RF_PLL_channel0 (C14B.2 C123B.1)
ADC_CLK_225_N: B2B_2 (J25.53), U_RF_PLL_channel0 (C126B.1 C171B.2)
ADC_CLK_225_P: B2B_2 (J25.55), U_RF_PLL_channel0 (C125B.1 C170B.2)
ADC_CLK_226_N: B2B_2 (J25.71), U_RF_PLL_channel1 (C15C.2 C124C.1)
ADC_CLK_226_P: B2B_2 (J25.73), U_RF_PLL_channel1 (C14C.2 C123C.1)
ADC_CLK_227_N: B2B_2 (J25.89), U_RF_PLL_channel1 (C126C.1 C171C.2)
ADC_CLK_227_P: B2B_2 (J25.91), U_RF_PLL_channel1 (C125C.1 C170C.2)
ALERT_N: B2B_1 (J24.15), PWR_5V (IC17.7 R20.2)
B128_CLK1_N: B2B_1 (J24.91), AWG_ClockRecovery (C48.2)
B128_CLK1_P: B2B_1 (J24.89), AWG_ClockRecovery (C47.2)
B128_RX0_N: FireFly_AB (J5.b15), B2B_1 (J24.97)
B128_RX0_P: FireFly_AB (J5.b14), B2B_1 (J24.95)
B128_RX1_N: FireFly_AB (J5.a15), B2B_1 (J24.103)
B128_RX1_P: FireFly_AB (J5.a14), B2B_1 (J24.101)
B128_RX2_N: FireFly_AB (J5.b18), B2B_1 (J24.109)
B128_RX2_P: FireFly_AB (J5.b17), B2B_1 (J24.107)
B128_RX3_N: FireFly_AB (J5.a18), B2B_1 (J24.115)
B128_RX3_P: FireFly_AB (J5.a17), B2B_1 (J24.113)
B128_TX0_N: FireFly_AB (J5.b2), B2B_1 (J24.100)
B128_TX0_P: FireFly_AB (J5.b3), B2B_1 (J24.98)
B128_TX1_N: FireFly_AB (J5.a2), B2B_1 (J24.106)
B128_TX1_P: FireFly_AB (J5.a3), B2B_1 (J24.104)
B128_TX2_N: FireFly_AB (J5.a5), B2B_1 (J24.112)
B128_TX2_P: FireFly_AB (J5.a6), B2B_1 (J24.110)
B128_TX3_N: FireFly_AB (J5.b5), B2B_1 (J24.118)
B128_TX3_P: FireFly_AB (J5.b6), B2B_1 (J24.116)
B129_CLK1_N: B2B_1 (J24.94), AWG_ClockRecovery (C46.2)
B129_CLK1_P: B2B_1 (J24.92), AWG_ClockRecovery (C45.2)
B129_RX0_N: B2B_1 (J24.121), AWG_SFPs (C247.2)
B129_RX0_P: B2B_1 (J24.119), AWG_SFPs (C246.2)
B129_RX1_N: B2B_1 (J24.127), AWG_SFPs (C251.2)
B129_RX1_P: B2B_1 (J24.125), AWG_SFPs (C250.2)
B129_RX2_N: B2B_1 (J24.133), AWG_CPCIS_Connectors_P1_P6 (J19.E5)
B129_RX2_P: B2B_1 (J24.131), AWG_CPCIS_Connectors_P1_P6 (J19.D5)
B129_TX0_N: B2B_1 (J24.124), AWG_SFPs (C249.2)
B129_TX0_P: B2B_1 (J24.122), AWG_SFPs (C248.2)
B129_TX1_N: B2B_1 (J24.130), AWG_SFPs (C253.2)
B129_TX1_P: B2B_1 (J24.128), AWG_SFPs (C252.2)
B129_TX2_N: B2B_1 (J24.136), AWG_CPCIS_Connectors_P1_P6 (J19.B5)
B129_TX2_P: B2B_1 (J24.134), AWG_CPCIS_Connectors_P1_P6 (J19.A5)
B505_RX0_N: FireFly_AB (J22.b15), B2B_1 (J24.67)
B505_RX0_P: FireFly_AB (J22.b14), B2B_1 (J24.65)
B505_RX1_N: FireFly_AB (J22.a15), B2B_1 (J24.73)
B505_RX1_P: FireFly_AB (J22.a14), B2B_1 (J24.71)
B505_RX2_N: FireFly_AB (J22.b18), B2B_1 (J24.79)
B505_RX2_P: FireFly_AB (J22.b17), B2B_1 (J24.77)
B505_RX3_N: FireFly_AB (J22.a18), B2B_1 (J24.85)
B505_RX3_P: FireFly_AB (J22.a17), B2B_1 (J24.83)
B505_TX0_N: FireFly_AB (J22.a2), B2B_1 (J24.70)
B505_TX0_P: FireFly_AB (J22.a3), B2B_1 (J24.68)
B505_TX1_N: FireFly_AB (J22.a5), B2B_1 (J24.76)
B505_TX1_P: FireFly_AB (J22.a6), B2B_1 (J24.74)
B505_TX2_N: FireFly_AB (J22.b5), B2B_1 (J24.82)
B505_TX2_P: FireFly_AB (J22.b6), B2B_1 (J24.80)
B505_TX3_N: FireFly_AB (J22.b2), B2B_1 (J24.88)
B505_TX3_P: FireFly_AB (J22.b3), B2B_1 (J24.86)
BP_I2C.SCL: AWG_CPCIS_Connectors_P1_P6 (D10.3 J19.B2), AWG_EEM_Connectors_JTAG (IC42.8)
BP_I2C.SDA: AWG_CPCIS_Connectors_P1_P6 (D10.1 J19.C2), AWG_EEM_Connectors_JTAG (IC42.7)
BP_IO.LVDS_N0: AWG_CPCIS_Connectors_P1_P6 (J19.E3), AWG_EEM_Connectors_JTAG (R235.1)
BP_IO.LVDS_N1: AWG_CPCIS_Connectors_P1_P6 (J19.B3), AWG_EEM_Connectors_JTAG (R236.1)
BP_IO.LVDS_N2: AWG_CPCIS_Connectors_P1_P6 (J19.C4), AWG_EEM_Connectors_JTAG (R241.1)
BP_IO.LVDS_N3: AWG_CPCIS_Connectors_P1_P6 (J19.L4), AWG_EEM_Connectors_JTAG (R242.1)
BP_IO.LVDS_N4: AWG_CPCIS_Connectors_P1_P6 (J19.I4), AWG_EEM_Connectors_JTAG (R243.1)
BP_IO.LVDS_N5: AWG_CPCIS_Connectors_P1_P6 (J19.K5), AWG_EEM_Connectors_JTAG (R168.1)
BP_IO.LVDS_N6: AWG_CPCIS_Connectors_P1_P6 (J19.H5), AWG_EEM_Connectors_JTAG (R247.1)
BP_IO.LVDS_N7: AWG_CPCIS_Connectors_P1_P6 (J19.F6), AWG_EEM_Connectors_JTAG (R248.1)
BP_IO.LVDS_P0: AWG_CPCIS_Connectors_P1_P6 (J19.D3), AWG_EEM_Connectors_JTAG (R145.1)
BP_IO.LVDS_P1: AWG_CPCIS_Connectors_P1_P6 (J19.A3), AWG_EEM_Connectors_JTAG (R146.1)
BP_IO.LVDS_P2: AWG_CPCIS_Connectors_P1_P6 (J19.B4), AWG_EEM_Connectors_JTAG (R147.1)
BP_IO.LVDS_P3: AWG_CPCIS_Connectors_P1_P6 (J19.K4), AWG_EEM_Connectors_JTAG (R148.1)
BP_IO.LVDS_P4: AWG_CPCIS_Connectors_P1_P6 (J19.H4), AWG_EEM_Connectors_JTAG (R149.1)
BP_IO.LVDS_P5: AWG_CPCIS_Connectors_P1_P6 (J19.J5), AWG_EEM_Connectors_JTAG (R150.1)
BP_IO.LVDS_P6: AWG_CPCIS_Connectors_P1_P6 (J19.G5), AWG_EEM_Connectors_JTAG (R151.1)
BP_IO.LVDS_P7: AWG_CPCIS_Connectors_P1_P6 (J19.E6), AWG_EEM_Connectors_JTAG (R152.1)
CE: U_RF_PLL_channel2 (IC45A.4), SPI_Extender (IC12.5)
CE: U_RF_PLL_channel0 (IC45B.4), SPI_Extender (IC12.3)
CE: U_RF_PLL_channel1 (IC45C.4), SPI_Extender (IC12.4)
CK_FPGAIO_N: B2B_2 (J25.23), AWG_ClockRecovery (C6.2 R73.2 R76.2)
CK_FPGAIO_P: B2B_2 (J25.25), AWG_ClockRecovery (C4.2 R75.2 R78.2)
CK_GTP_N: B2B_1 (J24.58), AWG_ClockRecovery (C50.2)
CK_GTP_P: B2B_1 (J24.56), AWG_ClockRecovery (C49.2)
CLK1_N: B2B_2 (J25.16), AWG_ClockRecovery (OSC3.5)
CLK1_P: B2B_2 (J25.18), AWG_ClockRecovery (R225.2)
CLK2_N: AWG_CLK_Connectors (IC29.4), B2B_2 (J25.20)
CLK2_P: AWG_CLK_Connectors (IC29.3), B2B_2 (J25.22)
CLK3_N: B2B_2 (J25.21), AWG_ClockRecovery (C214.1 R69.1)
CLK3_P: B2B_2 (J25.19), AWG_ClockRecovery (C212.1 R69.2)
CLK_SEL: AWG_ClockRecovery (IC23.32 R74.1 R77.2), SPI_Extender (IC12.2)
CPLD_IO2: B2B_1 (J24.32 R164.1 SW2.4), AWG_USB_Serial_Quad (IC41.5 TP5.1)
DAC0_N: B2B_2 (J25.101), U_DAC_Output_CH7 (R62H.2 R64H.1)
DAC0_N: B2B_2 (J25.107), U_DAC_Output_CH6 (R62G.2 R64G.1)
DAC0_N: B2B_2 (J25.119), U_DAC_Output_CH5 (R62F.2 R64F.1)
DAC0_N: B2B_2 (J25.125), U_DAC_Output_CH4 (R62E.2 R64E.1)
DAC0_N: B2B_2 (J25.131), U_DAC_Output_CH3 (R62D.2 R64D.1)
DAC0_N: B2B_2 (J25.137), U_DAC_Output_CH2 (R62C.2 R64C.1)
DAC0_N: B2B_2 (J25.149), U_DAC_Output_CH1 (R62B.2 R64B.1)
DAC0_N: B2B_2 (J25.155), U_DAC_Output_CH0 (R62A.2 R64A.1)
DAC0_P: B2B_2 (J25.103), U_DAC_Output_CH7 (R64H.2 R65H.2)
DAC0_P: B2B_2 (J25.109), U_DAC_Output_CH6 (R64G.2 R65G.2)
DAC0_P: B2B_2 (J25.121), U_DAC_Output_CH5 (R64F.2 R65F.2)
DAC0_P: B2B_2 (J25.127), U_DAC_Output_CH4 (R64E.2 R65E.2)
DAC0_P: B2B_2 (J25.133), U_DAC_Output_CH3 (R64D.2 R65D.2)
DAC0_P: B2B_2 (J25.139), U_DAC_Output_CH2 (R64C.2 R65C.2)
DAC0_P: B2B_2 (J25.151), U_DAC_Output_CH1 (R64B.2 R65B.2)
DAC0_P: B2B_2 (J25.157), U_DAC_Output_CH0 (R64A.2 R65A.2)
DAC_CLK_228_N: B2B_2 (J25.113), U_RF_PLL_channel2 (C15A.2 C124A.1)
DAC_CLK_228_P: B2B_2 (J25.115), U_RF_PLL_channel2 (C14A.2 C123A.1)
DAC_CLK_229_N: B2B_2 (J25.143), U_RF_PLL_channel2 (C126A.1 C171A.2)
DAC_CLK_229_P: B2B_2 (J25.145), U_RF_PLL_channel2 (C125A.1 C170A.2)
DAC_OUT0: RFSOC_SAWG (J10#2.1), U_DAC_Output_CH0 (FL3A.3)
DAC_OUT1: RFSOC_SAWG (J12#2.1), U_DAC_Output_CH1 (FL3B.3)
DAC_OUT2: RFSOC_SAWG (J14#2.1), U_DAC_Output_CH2 (FL3C.3)
DAC_OUT3: RFSOC_SAWG (J16#2.1), U_DAC_Output_CH3 (FL3D.3)
DAC_OUT4: RFSOC_SAWG (J20.1), U_DAC_Output_CH4 (FL3E.3)
DAC_OUT5: RFSOC_SAWG (J27.1), U_DAC_Output_CH5 (FL3F.3)
DAC_OUT6: RFSOC_SAWG (J35.1), U_DAC_Output_CH6 (FL3G.3)
DAC_OUT7: RFSOC_SAWG (J36.1), U_DAC_Output_CH7 (FL3H.3)
DAC_SYSREFCLK_N: RFSOC_SAWG (J37.1), B2B_2 (J25.110)
DAC_SYSREFCLK_P: RFSOC_SAWG (J39.1), B2B_2 (J25.108)
DCDC_EN: RFSOC_SAWG (R105.2 R106.2), PWR_3V3 (IC2.1 IC52.1)
EEM0_I2C.SCL: PWR_5V (IC33.2), AWG_EEM_Connectors_JTAG (5 pins)
EEM0_I2C.SDA: PWR_5V (IC33.1), AWG_EEM_Connectors_JTAG (5 pins)
EEM_IO.LVDS_N0: B2B_2 (J25.13), AWG_EEM_Connectors_JTAG (IC27.18)
EEM_IO.LVDS_N1: B2B_2 (J25.17), AWG_EEM_Connectors_JTAG (IC27.16)
EEM_IO.LVDS_N2: B2B_2 (J25.9), AWG_EEM_Connectors_JTAG (IC28.18)
EEM_IO.LVDS_N3: B2B_2 (J25.5), AWG_EEM_Connectors_JTAG (IC28.16)
EEM_IO.LVDS_N4: B2B_2 (J25.26), AWG_EEM_Connectors_JTAG (IC42.18)
EEM_IO.LVDS_N5: B2B_2 (J25.12), AWG_EEM_Connectors_JTAG (J32.18 R168.2)
EEM_IO.LVDS_N6: B2B_2 (J25.8), AWG_EEM_Connectors_JTAG (J32.21 R247.2)
EEM_IO.LVDS_N7: B2B_2 (J25.4), AWG_EEM_Connectors_JTAG (J32.24 R248.2)
EEM_IO.LVDS_P0: B2B_2 (J25.11), AWG_EEM_Connectors_JTAG (IC27.19)
EEM_IO.LVDS_P1: B2B_2 (J25.15), AWG_EEM_Connectors_JTAG (IC27.17)
EEM_IO.LVDS_P2: B2B_2 (J25.7), AWG_EEM_Connectors_JTAG (IC28.19)
EEM_IO.LVDS_P3: B2B_2 (J25.3), AWG_EEM_Connectors_JTAG (IC28.17)
EEM_IO.LVDS_P4: B2B_2 (J25.24), AWG_EEM_Connectors_JTAG (IC42.19)
EEM_IO.LVDS_P5: B2B_2 (J25.14), AWG_EEM_Connectors_JTAG (J32.17 R150.2)
EEM_IO.LVDS_P6: B2B_2 (J25.10), AWG_EEM_Connectors_JTAG (J32.20 R151.2)
EEM_IO.LVDS_P7: B2B_2 (J25.6), AWG_EEM_Connectors_JTAG (J32.23 R152.2)
EN_clk_3V6: RFSOC_SAWG (R106.1), B2B_1 (J24.34), PWR_5V (IC47.3), AWG_ClockRecovery (IC19.5)
EN_USB_JTAG: AWG_EEM_Connectors_JTAG (C53.2 J34.13 R58.1 T13.3), AWG_USB_Serial_Quad (T3.1)
EXT_CLK_IN1_N: B2B_2 (J25.158), AWG_ClockRecovery (C44.2)
EXT_CLK_IN1_P: B2B_2 (J25.156), AWG_ClockRecovery (C35.2)
EXT_CLK_SEL: AWG_CLK_Connectors (IC29.9), SPI_Extender (IC12.7)
FFA_INTL: FireFly_AB (J6.5), SPI_Extender (IC49.11)
FFA_MPRS: FireFly_AB (J6.3 R191.2), SPI_Extender (IC49.13)
FFA_MSEL: FireFly_AB (J6.4), SPI_Extender (IC34.15)
FFA_RSTL: FireFly_AB (J6.6), SPI_Extender (IC34.3)
FFA_SCL: FireFly_AB (J6.8), I2C_MUX (IC15.4 IC35.7 R44.1)
FFA_SDA: FireFly_AB (J6.7), I2C_MUX (IC15.3 IC35.6 R43.1)
FFB_INTL: FireFly_AB (J23.5), SPI_Extender (IC49.12)
FFB_MPRS: FireFly_AB (J23.3 R23.2), SPI_Extender (IC49.14)
FFB_MSEL: FireFly_AB (J23.4), SPI_Extender (IC34.2)
FFB_RSTL: FireFly_AB (J23.6), SPI_Extender (IC34.1)
FFB_SCL: FireFly_AB (J23.8), I2C_MUX (IC15.2 IC35.5 R42.1)
FFB_SDA: FireFly_AB (J23.7), I2C_MUX (IC15.1 IC35.4 R33.1)
FPGA_UART_RX: B2B_2 (J25.140), AWG_USB_Serial_Quad (IC41.4 TP6.1)
GA0: AWG_CPCIS_Connectors_P1_P6 (R217.1), SPI_Extender (IC51.3)
GA1: AWG_CPCIS_Connectors_P1_P6 (R218.1), SPI_Extender (IC51.4)
GA2: AWG_CPCIS_Connectors_P1_P6 (R136.1), SPI_Extender (IC51.5)
GA3: AWG_CPCIS_Connectors_P1_P6 (R140.1), SPI_Extender (IC51.6)
Helper_DCXO_OE: AWG_ClockRecovery (R89.1 R91.2 R97.1 R98.2), SPI_Extender (IC12.1)
Helper_DCXO_SCL: B2B_2 (J25.148), AWG_ClockRecovery (OSC3.8 R50.1 TP24.1)
Helper_DCXO_SDA: B2B_2 (J25.146), AWG_ClockRecovery (OSC3.7 R41.1 TP23.1)
HW_REV0: RFSOC_SAWG (R141.1), SPI_Extender (IC51.11)
HW_REV1: RFSOC_SAWG (R142.1), SPI_Extender (IC51.12)
HW_REV2: RFSOC_SAWG (R144.1), SPI_Extender (IC51.13)
HW_REV3: RFSOC_SAWG (R154.1), SPI_Extender (IC51.14)
I2C0_1V8_SCL: I2C_MUX (IC13.3 R166.1 TP14.1), B2B_1 (J24.11)
I2C0_1V8_SDA: I2C_MUX (IC13.4 R165.1 TP13.1), B2B_1 (J24.13)
I2C_CDR_SCL: I2C_MUX (IC15.13 IC35.16 R57.1), AWG_ClockRecovery (R86.1)
I2C_CDR_SDA: I2C_MUX (IC15.12 IC35.15 R55.1), AWG_ClockRecovery (R84.1)
I2C_SCL_SNS: I2C_MUX (IC15.15 IC35.18 R102.1 R174.1), PWR_5V (IC17.10)
I2C_SDA_SNS: I2C_MUX (IC15.14 IC35.17 R101.1 R230.1), PWR_5V (IC17.9)
I2C_SW_RESET: I2C_MUX (R171.2 T21.1), SPI_Extender (IC12.6)
I2C_SW_RESET2: I2C_MUX (R172.2 T22.1), AWG_USB_Serial_Quad (IC7.27)
JTAG_TCK: B2B_1 (J24.22), AWG_EEM_Connectors_JTAG (IC16.4), AWG_USB_Serial_Quad (IC6.4)
JTAG_TDI: B2B_1 (J24.20), AWG_EEM_Connectors_JTAG (IC16.12), AWG_USB_Serial_Quad (IC6.5)
JTAG_TDO: B2B_1 (J24.18), AWG_EEM_Connectors_JTAG (IC16.9), AWG_USB_Serial_Quad (IC8.4)
JTAG_TMS: B2B_1 (J24.24), AWG_EEM_Connectors_JTAG (IC16.7), AWG_USB_Serial_Quad (IC8.5)
JTAG_TRSTn: B2B_1 (R32.2), AWG_EEM_Connectors_JTAG (IC26.4)
LE: B2B_2 (IC21.4), U_RF_PLL_channel0 (IC45B.3)
LE: B2B_2 (IC21.5), U_RF_PLL_channel1 (IC45C.3)
LE: B2B_2 (IC21.6), U_RF_PLL_channel2 (IC45A.3)
Main_DCXO_OE: AWG_ClockRecovery (R36.1 R38.2 R88.1 R90.2), SPI_Extender (IC12.15)
Main_DCXO_SCL: B2B_2 (J25.144), AWG_ClockRecovery (OSC1.8 R35.1 TP30.1)
Main_DCXO_SDA: B2B_2 (J25.142), AWG_ClockRecovery (OSC1.7 R34.1 TP29.1)
MUXOUT: U_RF_PLL_channel2 (B14A.1 IC45A.30), SPI_Extender (IC49.6)
MUXOUT: U_RF_PLL_channel0 (B14B.1 IC45B.30), SPI_Extender (IC49.4)
MUXOUT: U_RF_PLL_channel1 (B14C.1 IC45C.30), SPI_Extender (IC49.5)
NetJ7_1: RFSOC_SAWG (J7.1), AWG_CLK_Connectors (R231.1)
PE_CLK.CLK_N: AWG_CLK_Connectors (IC29.18), AWG_CPCIS_Connectors_P1_P6 (R216.1)
PE_CLK.CLK_P: AWG_CLK_Connectors (IC29.19), AWG_CPCIS_Connectors_P1_P6 (R124.1)
PG_1.8V: RFSOC_SAWG (R3#1.2 T5.1), PWR_3V3 (IC2.11 IC18.4 IC52.2), PWR_1V8 (IC1.4), PWR_5V (IC47.4), AWG_ClockRecovery (IC10.4 IC11.4 IC20.4), SPI_Extender (IC12.10 IC32.10 IC34.10 IC43.10)
PG_5V: RFSOC_SAWG (R105.1), PWR_5V (IC36.B5 R28.1 R121.2 T23.1)
PHY_LED0: RFSOC_SAWG (P1.25), B2B_1 (J24.50)
PHY_LED1: RFSOC_SAWG (P1.27), B2B_1 (J24.52)
PHY_MDI0_N: RFSOC_SAWG (P1.10), B2B_1 (J24.148)
PHY_MDI0_P: RFSOC_SAWG (P1.8), B2B_1 (J24.146)
PHY_MDI1_N: RFSOC_SAWG (P1.16), B2B_1 (J24.154)
PHY_MDI1_P: RFSOC_SAWG (P1.14), B2B_1 (J24.152)
PHY_MDI2_N: RFSOC_SAWG (P1.22), B2B_1 (J24.145)
PHY_MDI2_P: RFSOC_SAWG (P1.20), B2B_1 (J24.143)
PHY_MDI3_N: RFSOC_SAWG (P1.28), B2B_1 (J24.151)
PHY_MDI3_P: RFSOC_SAWG (P1.26), B2B_1 (J24.149)
QSFP0_SCL: RFSOC_SAWG (P1.7), I2C_MUX (IC15.6 IC35.9 R46.1)
QSFP0_SDA: RFSOC_SAWG (P1.9), I2C_MUX (IC15.5 IC35.8 R45.1)
RFPLL_REFin0_N: AWG_ClockRecovery (C34.2), U_RF_PLL_channel2 (C27A.1 R107A.2)
RFPLL_REFin0_P: AWG_ClockRecovery (C33.2), U_RF_PLL_channel2 (C13A.1 R107A.1)
RFPLL_REFin1_N: AWG_ClockRecovery (C32.2), U_RF_PLL_channel1 (C27C.1 R107C.2)
RFPLL_REFin1_P: AWG_ClockRecovery (C31.2), U_RF_PLL_channel1 (C13C.1 R107C.1)
RFPLL_REFin2_N: AWG_ClockRecovery (C11.2), U_RF_PLL_channel0 (C27B.1 R107B.2)
RFPLL_REFin2_P: AWG_ClockRecovery (C8.2), U_RF_PLL_channel0 (C13B.1 R107B.1)
RFPLL_SCKI: B2B_2 (J25.132), U_RF_PLL_channel2 (IC45A.1), U_RF_PLL_channel0 (IC45B.1), U_RF_PLL_channel1 (IC45C.1)
RFPLL_SDI: B2B_2 (J25.134), U_RF_PLL_channel2 (IC45A.2), U_RF_PLL_channel0 (IC45B.2), U_RF_PLL_channel1 (IC45C.2)
RFSW_CTRL0: U_DAC_Output_CH0 (IC24A.2 R273A.2), SPI_Extender (IC43.15)
RFSW_CTRL1: U_DAC_Output_CH1 (IC24B.2 R273B.2), SPI_Extender (IC43.1)
RFSW_CTRL2: U_DAC_Output_CH2 (IC24C.2 R273C.2), SPI_Extender (IC43.2)
RFSW_CTRL3: U_DAC_Output_CH3 (IC24D.2 R273D.2), SPI_Extender (IC43.3)
RFSW_CTRL4: U_DAC_Output_CH4 (IC24E.2 R273E.2), SPI_Extender (IC43.4)
RFSW_CTRL5: U_DAC_Output_CH5 (IC24F.2 R273F.2), SPI_Extender (IC43.5)
RFSW_CTRL6: U_DAC_Output_CH6 (IC24G.2 R273G.2), SPI_Extender (IC43.6)
RFSW_CTRL7: U_DAC_Output_CH7 (IC24H.2 R273H.2), SPI_Extender (IC43.7)
RST_N: PWR_5V (IC36.B4 R187.1 R188.2), AWG_CPCIS_Connectors_P1_P6 (R276.2)
SD_CD: SD (J28.9 R202.1), B2B_1 (J24.49)
SD_CLK: SD (IC4.9), B2B_1 (J24.61)
SD_CMD: SD (IC4.4), B2B_1 (J24.59)
SD_DAT0: SD (IC4.6), B2B_1 (J24.51)
SD_DAT1: SD (IC4.7), B2B_1 (J24.53)
SD_DAT2: SD (IC4.1), B2B_1 (J24.55)
SD_DAT3: SD (IC4.3), B2B_1 (J24.57)
SERVMOD_3V3: AWG_CPCIS_Connectors_P1_P6 (R138.1), AWG_EEM_Connectors_JTAG (7 pins)
SFP0_LED: AWG_SFPs (T11.1), SPI_Extender (IC32.6)
SFP0_LOS: AWG_SFPs (J53.T8 R284.1), SPI_Extender (IC50.3)
SFP0_MOD_PRESENT: AWG_SFPs (J53.T6 R285.1), SPI_Extender (IC50.13)
SFP0_RATE_SELECT: AWG_SFPs (J53.T7 R288.2), SPI_Extender (IC32.2)
SFP0_RATE_SELECT1: AWG_SFPs (J53.T9 R130.2), SPI_Extender (IC32.4)
SFP0_SCL: I2C_MUX (IC15.8 IC35.11 R51.1), AWG_SFPs (J53.T5)
SFP0_SDA: I2C_MUX (IC15.7 IC35.10 R49.1), AWG_SFPs (J53.T4)
SFP0_TX_DISABLE: AWG_SFPs (J53.T3 R287.2), SPI_Extender (IC32.15)
SFP0_TX_FAULT: AWG_SFPs (J53.T2 R134.1), SPI_Extender (IC50.11)
SFP1_LED: AWG_SFPs (T16.1), SPI_Extender (IC32.7)
SFP1_LOS: AWG_SFPs (J53.L8 R291.1), SPI_Extender (IC50.4)
SFP1_MOD_PRESENT: AWG_SFPs (J53.L6 R292.1), SPI_Extender (IC50.14)
SFP1_RATE_SELECT: AWG_SFPs (J53.L7 R294.2), SPI_Extender (IC32.3)
SFP1_RATE_SELECT1: AWG_SFPs (J53.L9 R295.2), SPI_Extender (IC32.5)
SFP1_SCL: I2C_MUX (IC15.11 IC35.14 R53.1), AWG_SFPs (J53.L5)
SFP1_SDA: I2C_MUX (IC15.10 IC35.13 R52.1), AWG_SFPs (J53.L4)
SFP1_TX_DISABLE: AWG_SFPs (J53.L3 R293.2), SPI_Extender (IC32.1)
SFP1_TX_FAULT: AWG_SFPs (J53.L2 R290.1), SPI_Extender (IC50.12)
SHARED_BUS_0: AWG_CPCIS_Connectors_P1_P6 (R137.1), SPI_Extender (IC48.14)
SHARED_BUS_1: AWG_CPCIS_Connectors_P1_P6 (R139.1), SPI_Extender (IC48.3)
SHARED_BUS_2: AWG_CPCIS_Connectors_P1_P6 (R135.1), SPI_Extender (IC48.4)
SHARED_BUS_3: AWG_CPCIS_Connectors_P1_P6 (R220.1), SPI_Extender (IC48.5)
SHARED_BUS_4: AWG_CPCIS_Connectors_P1_P6 (R221.1), SPI_Extender (IC48.6)
SPI_CLK: B2B_2 (J25.124), SPI_Extender (8 pins)
SPI_CSn: B2B_2 (J25.126), SPI_Extender (6 pins)
SPI_LDn: B2B_2 (J25.130), SPI_Extender (IC48.1 IC50.1)
SPI_MISO: B2B_2 (J25.128), SPI_Extender (IC51.9)
SPI_MOSI: B2B_2 (J25.122), SPI_Extender (IC12.14)
UART0_RX: B2B_1 (J24.43), AWG_USB_Serial_Quad (IC40.4 TP17.1)
UART0_TX: B2B_1 (J24.45), AWG_USB_Serial_Quad (IC40.5 TP16.1)
USB0_CPEN: RFSOC_SAWG (P1.23), B2B_1 (J24.155 R122.2)
USB0_D_N: RFSOC_SAWG (P1.17), B2B_1 (J24.160)
USB0_D_P: RFSOC_SAWG (P1.15), B2B_1 (J24.158)
USB0_ID: RFSOC_SAWG (P1.21), B2B_1 (J24.159)
USB0_VBUS: RFSOC_SAWG (P1.11), B2B_1 (J24.157)
USB_SCL: I2C_MUX (IC13.6 IC15.19 IC35.22 R169.1), AWG_USB_Serial_Quad (IC9.3 TP19.1)
USB_SDA: I2C_MUX (IC13.5 IC15.20 IC35.23 R167.1), AWG_USB_Serial_Quad (IC9.4 TP18.1)

## Assembly variants
Si549 CMOS: not fitted C189 R36 R39 R40 R97
Si549 LVDS: not fitted IC3 IC52 IC53 R11A R11B R11C R11D R11E R11F R11G R11H R38 R39 R40 R96A R96B R96C R96D R96E R96F R96G R96H R98 R105 R199 R232; alternate parts OSC1 -> OSC_0.2-800MHZ_SILICON-LAB_549BACB001937ABG, OSC3 -> OSC_0.2-800MHZ_SILICON-LAB_549BACB001937ABG, R225 -> R0402_0R_JUMPER, R37 -> R0402_0R_JUMPER